# EAGLE schematic UpTo11.MotherBoard (EAGLE 7.6.0)
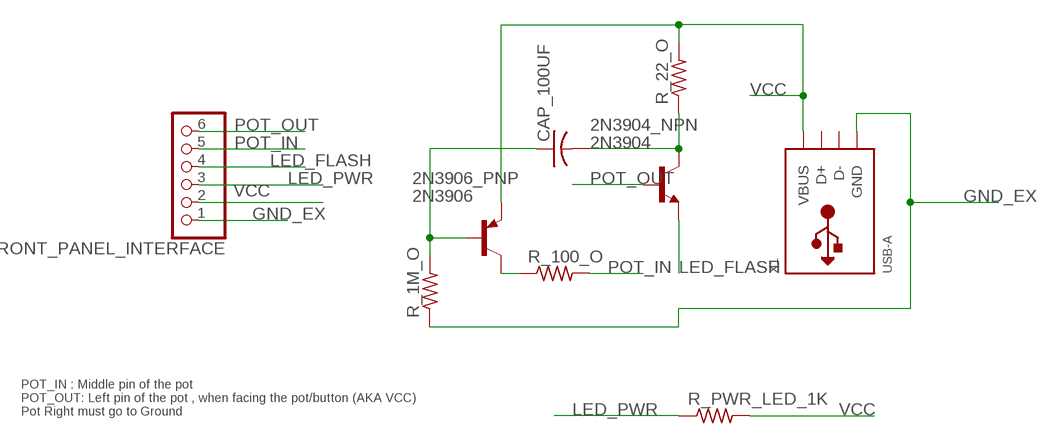
[diagram p0: schematic, sheet 1]

## Parts
2N3904_NPN  2N3904  [TO92]
2N3906_PNP  2N3906  [TO92]
CAP_100UF  C-US025-030X050  [C025-030X050]
FRONT_PANEL_INTERFACE  PINHD-1X6  [1X06]
R_1M_O  R-US_0207/10  [0207/10]
R_22_O  R-US_0207/10  [0207/10]
R_100_O  R-US_0207/10  [0207/10]
R_PWR_LED_1K  R-US_0207/10  [0207/10]
X1  USB-A  [MOLEX_480371000]

## Nets
GND_EX: FRONT_PANEL_INTERFACE.1 R_1M_O.1 X1.4(GND)
LED_FLASH: 2N3904_NPN.3(E) FRONT_PANEL_INTERFACE.4
LED_PWR: FRONT_PANEL_INTERFACE.3 R_PWR_LED_1K.1
N$2: 2N3904_NPN.1(C) CAP_100UF.2 R_22_O.1
N$5: 2N3906_PNP.2(B) CAP_100UF.1 R_1M_O.2
N$6: 2N3906_PNP.1(C) R_100_O.1
POT_IN: FRONT_PANEL_INTERFACE.5 R_100_O.2
POT_OUT: 2N3904_NPN.2(B) FRONT_PANEL_INTERFACE.6
VCC: 2N3906_PNP.3(E) FRONT_PANEL_INTERFACE.2 R_22_O.2 R_PWR_LED_1K.2 X1.1(VBUS)
Unconnected: X1.2(D-) X1.3(D+)

## Notes on the sheet
- POT_IN : Middle pin of the pot
  POT_OUT: Left pin of the pot , when facing the pot/button (AKA VCC)
  Pot Right must go to Ground

## Library data of the parts
2N3904_NPN = transistor:2N3904: NPN TRANSISTOR
2N3906_PNP = transistor-pnp:2N3906: PNP Transistor
CAP_100UF = adafruit:C-US: CAPACITOR, American symbol
FRONT_PANEL_INTERFACE = adafruit:PINHD-1X6: PIN HEADER
R_1M_O R_22_O R_100_O R_PWR_LED_1K = adafruit:R-US_: RESISTOR, American symbol
X1 = adafruit:USB-A: USB type A 'plug' Used for things that can directly connect to a USB port, say USB key